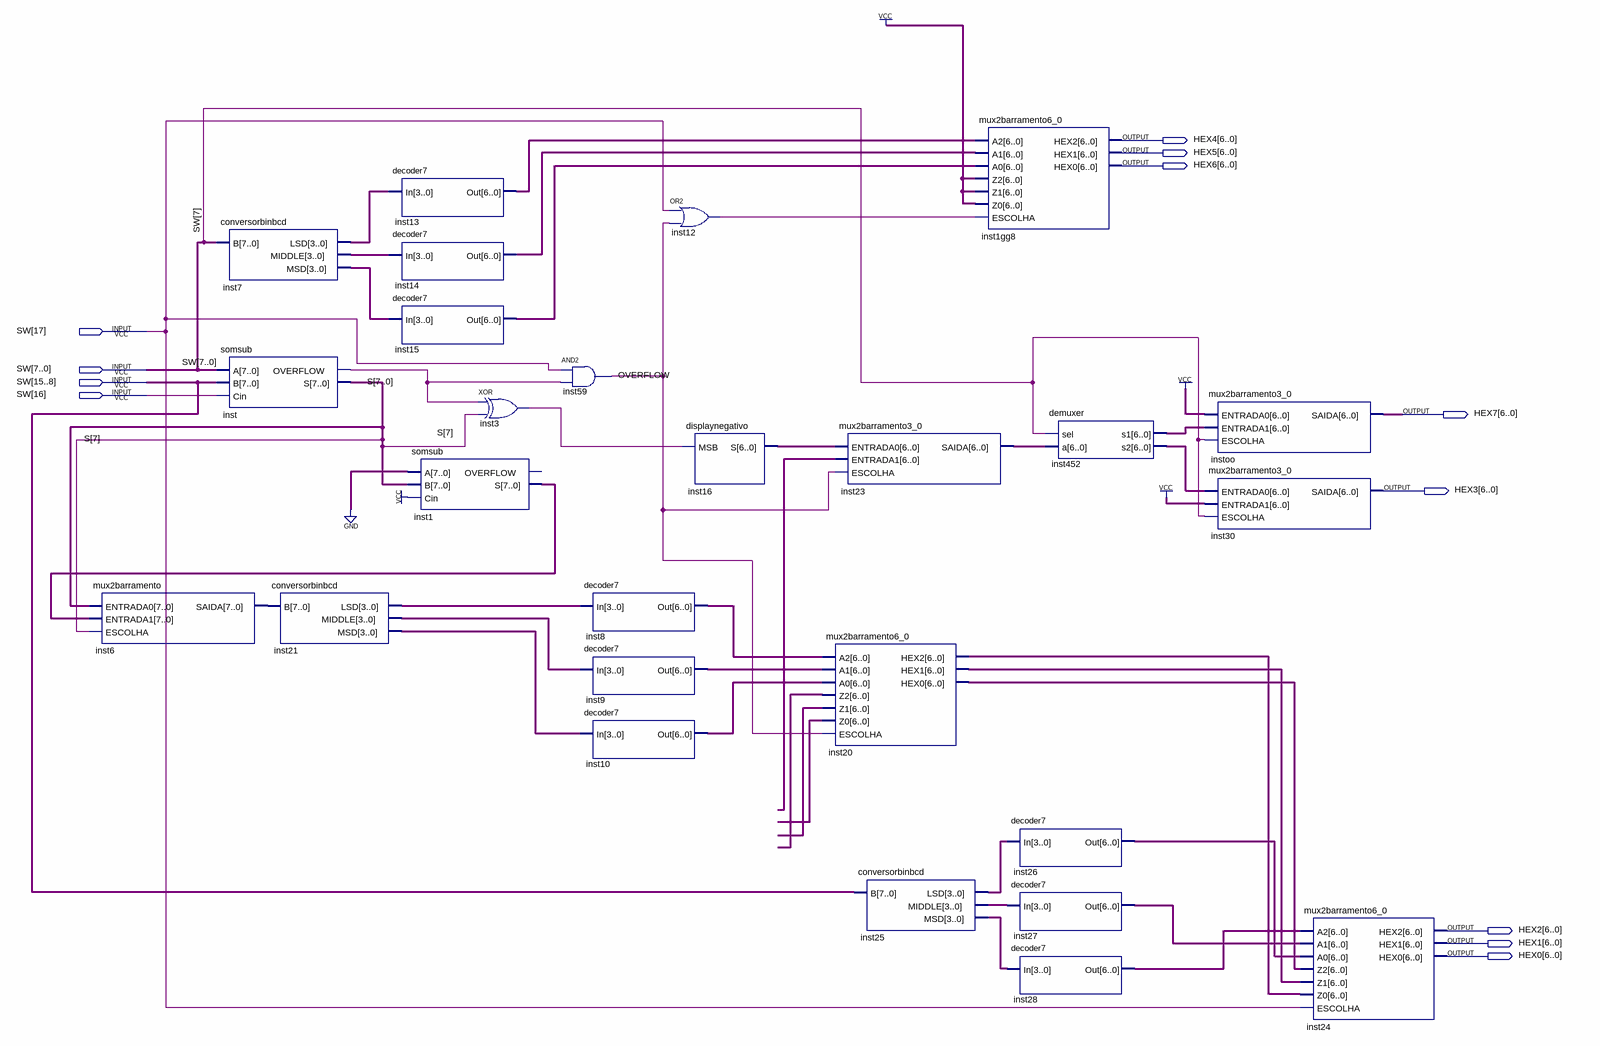
[diagram p0: schematic sheet]
// Quartus schematic Pre-Projeto.bdf as structural Verilog: 26 symbols, 12 pins
module \Pre-Projeto  (
  input  [17:0] SW,
  output [6:0] HEX4,
  output [6:0] HEX5,
  output [6:0] HEX6,
  output [6:0] HEX7,
  output [6:0] HEX3,
  output [6:0] HEX2,
  output [6:0] HEX1,
  output [6:0] HEX0
);

  wire inst3_out, inst12_out, inst_overflow, OVERFLOW;
  wire [3:0] inst7_lsd, inst7_middle, inst7_msd, inst21_lsd, inst21_middle, inst21_msd, inst25_lsd,
       inst25_middle, inst25_msd;
  wire [6:0] inst8_out, inst9_out, inst10_out, inst13_out, inst14_out, inst15_out, inst16_s, inst20_hex0,
       inst20_hex1, inst20_hex2, inst23_saida, inst26_out, inst27_out, inst28_out, inst452_s1, inst452_s2,
       undriven, undriven_2, undriven_3, undriven_4;
  wire [7:0] inst1_s, inst6_saida, S;

  mux2barramento inst6 (.ENTRADA0(S), .ENTRADA1(inst1_s), .ESCOLHA(S[7]), .SAIDA(inst6_saida));
  conversorbinbcd inst7 (.B(SW[7:0]), .LSD(inst7_lsd), .MIDDLE(inst7_middle), .MSD(inst7_msd));
  somsub inst (.A(SW[7:0]), .B(SW[15:8]), .Cin(SW[16]), .OVERFLOW(inst_overflow), .S(S));
  conversorbinbcd inst21 (.B(inst6_saida), .LSD(inst21_lsd), .MIDDLE(inst21_middle), .MSD(inst21_msd));
  decoder7 inst13 (.In(inst7_lsd), .Out(inst13_out));
  decoder7 inst14 (.In(inst7_middle), .Out(inst14_out));
  decoder7 inst15 (.In(inst7_msd), .Out(inst15_out));
  somsub inst1 (.A({8{1'b0}}), .B(S), .Cin(1'b1), .S(inst1_s));  // open: OVERFLOW
  xor inst3 (inst3_out, inst_overflow, S[7]);
  and inst59 (OVERFLOW, SW[17], inst_overflow);
  decoder7 inst8 (.In(inst21_lsd), .Out(inst8_out));
  decoder7 inst9 (.In(inst21_middle), .Out(inst9_out));
  decoder7 inst10 (.In(inst21_msd), .Out(inst10_out));
  or inst12 (inst12_out, SW[17], OVERFLOW);
  displaynegativo inst16 (.MSB(inst3_out), .S(inst16_s));
  mux2barramento3_0 inst23 (.ENTRADA0(inst16_s), .ENTRADA1(undriven_2), .ESCOLHA(OVERFLOW), .SAIDA(inst23_saida));
  mux2barramento6_0 inst20 (
    .A2(inst8_out), .A1(inst9_out), .A0(inst10_out), .Z2(undriven_3), .Z1(undriven), .Z0(undriven_4),
    .ESCOLHA(OVERFLOW), .HEX2(inst20_hex2), .HEX1(inst20_hex1), .HEX0(inst20_hex0));
  conversorbinbcd inst25 (.B(SW[15:8]), .LSD(inst25_lsd), .MIDDLE(inst25_middle), .MSD(inst25_msd));
  mux2barramento6_0 inst1gg8 (
    .A2(inst13_out), .A1(inst14_out), .A0(inst15_out), .Z2({7{1'b1}}), .Z1({7{1'b1}}), .Z0({7{1'b1}}),
    .ESCOLHA(inst12_out), .HEX2(HEX4), .HEX1(HEX5), .HEX0(HEX6));
  decoder7 inst26 (.In(inst25_lsd), .Out(inst26_out));
  decoder7 inst27 (.In(inst25_middle), .Out(inst27_out));
  decoder7 inst28 (.In(inst25_msd), .Out(inst28_out));
  demuxer inst452 (.sel(SW[7]), .a(inst23_saida), .s1(inst452_s1), .s2(inst452_s2));
  mux2barramento3_0 instoo (.ENTRADA0({7{1'b1}}), .ENTRADA1(inst452_s1), .ESCOLHA(SW[7]), .SAIDA(HEX7));
  mux2barramento3_0 inst30 (.ENTRADA0(inst452_s2), .ENTRADA1({7{1'b1}}), .ESCOLHA(SW[7]), .SAIDA(HEX3));
  mux2barramento6_0 inst24 (
    .A2(inst28_out), .A1(inst27_out), .A0(inst26_out), .Z2(inst20_hex0), .Z1(inst20_hex1), .Z0(inst20_hex2),
    .ESCOLHA(SW[17]), .HEX2(HEX2), .HEX1(HEX1), .HEX0(HEX0));
endmodule
